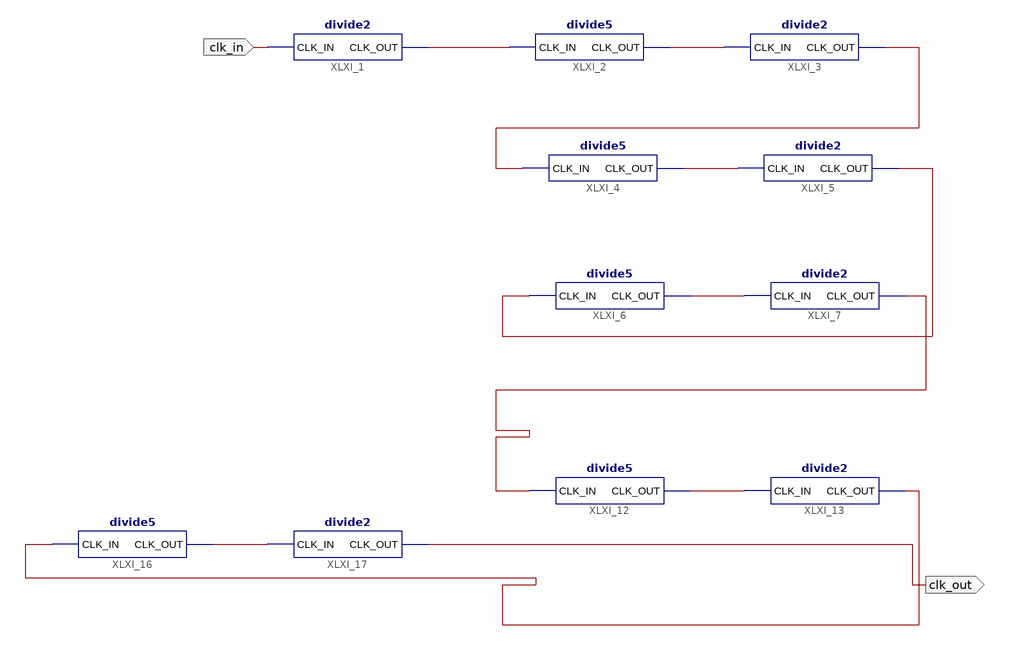
[diagram p0: schematic sheet 1]
// Xilinx ISE schematic divider.sch (spartan6) as structural Verilog: 11 symbols, 2 ports
module divider (
  input  clk_in,
  output clk_out
);

  wire XLXN_2, XLXN_3, XLXN_4, XLXN_5, XLXN_6, XLXN_7, XLXN_12, XLXN_19, XLXN_22, XLXN_23;

  divide2 XLXI_1 (.CLK_IN(clk_in), .CLK_OUT(XLXN_2));
  divide5 XLXI_2 (.CLK_IN(XLXN_2), .CLK_OUT(XLXN_3));
  divide2 XLXI_3 (.CLK_IN(XLXN_3), .CLK_OUT(XLXN_4));
  divide5 XLXI_4 (.CLK_IN(XLXN_4), .CLK_OUT(XLXN_5));
  divide2 XLXI_5 (.CLK_IN(XLXN_5), .CLK_OUT(XLXN_6));
  divide5 XLXI_6 (.CLK_IN(XLXN_6), .CLK_OUT(XLXN_7));
  divide2 XLXI_7 (.CLK_IN(XLXN_7), .CLK_OUT(XLXN_12));
  divide5 XLXI_16 (.CLK_IN(XLXN_22), .CLK_OUT(XLXN_23));
  divide2 XLXI_17 (.CLK_IN(XLXN_23), .CLK_OUT(clk_out));
  divide2 XLXI_13 (.CLK_IN(XLXN_19), .CLK_OUT(XLXN_22));
  divide5 XLXI_12 (.CLK_IN(XLXN_12), .CLK_OUT(XLXN_19));
endmodule
